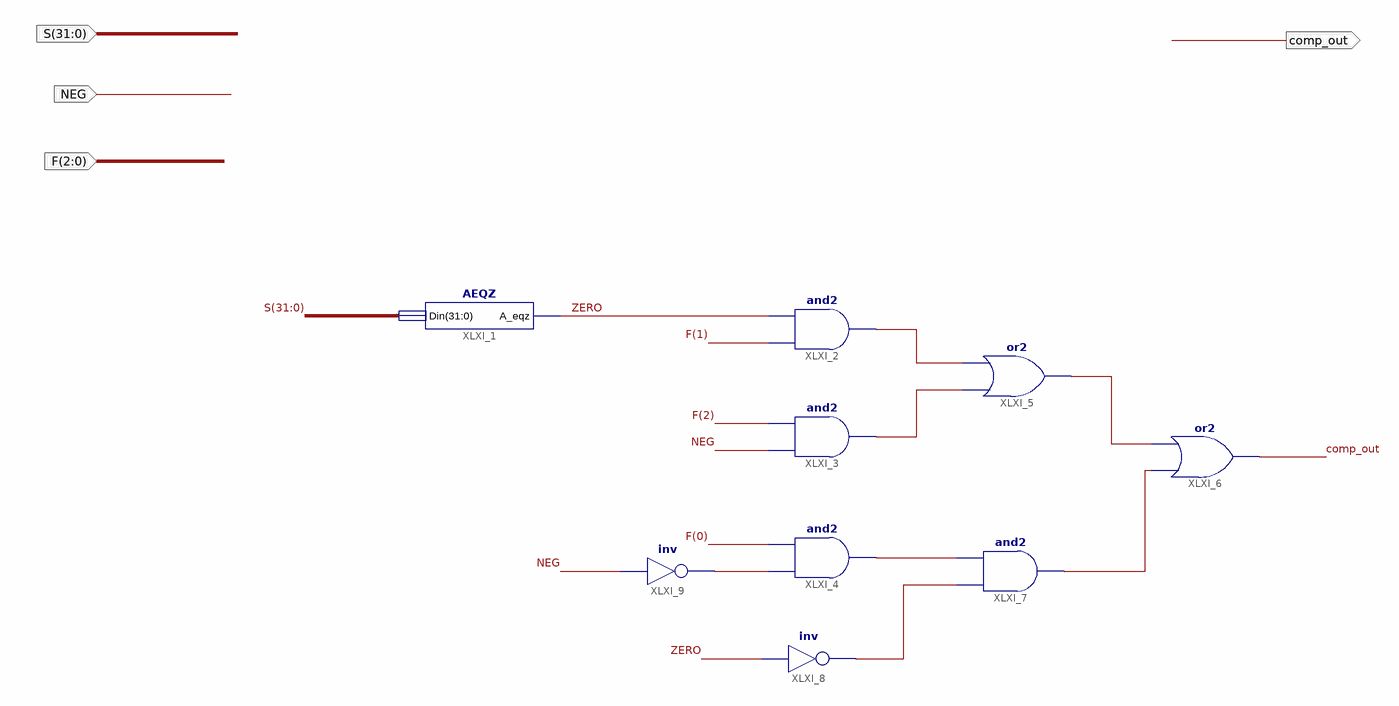
[diagram p0: schematic sheet 1]
// Xilinx ISE schematic comparator.sch (spartan6) as structural Verilog: 9 symbols, 4 ports
module comparator (
  input  [31:0] S,
  input  NEG,
  input  [2:0] F,
  output comp_out
);

  wire XLXN_6, XLXN_7, XLXN_8, XLXN_9, XLXN_10, XLXN_15, XLXN_16, ZERO;

  AEQZ XLXI_1 (.Din(S), .A_eqz(ZERO));
  and XLXI_2 (XLXN_8, F[1], ZERO);
  and XLXI_3 (XLXN_9, NEG, F[2]);
  and XLXI_4 (XLXN_10, XLXN_15, F[0]);
  or XLXI_5 (XLXN_6, XLXN_9, XLXN_8);
  or XLXI_6 (comp_out, XLXN_7, XLXN_6);
  and XLXI_7 (XLXN_7, XLXN_16, XLXN_10);
  not XLXI_8 (XLXN_16, ZERO);
  not XLXI_9 (XLXN_15, NEG);
endmodule
